# EAGLE design usb-can (EAGLE 9.1.3)
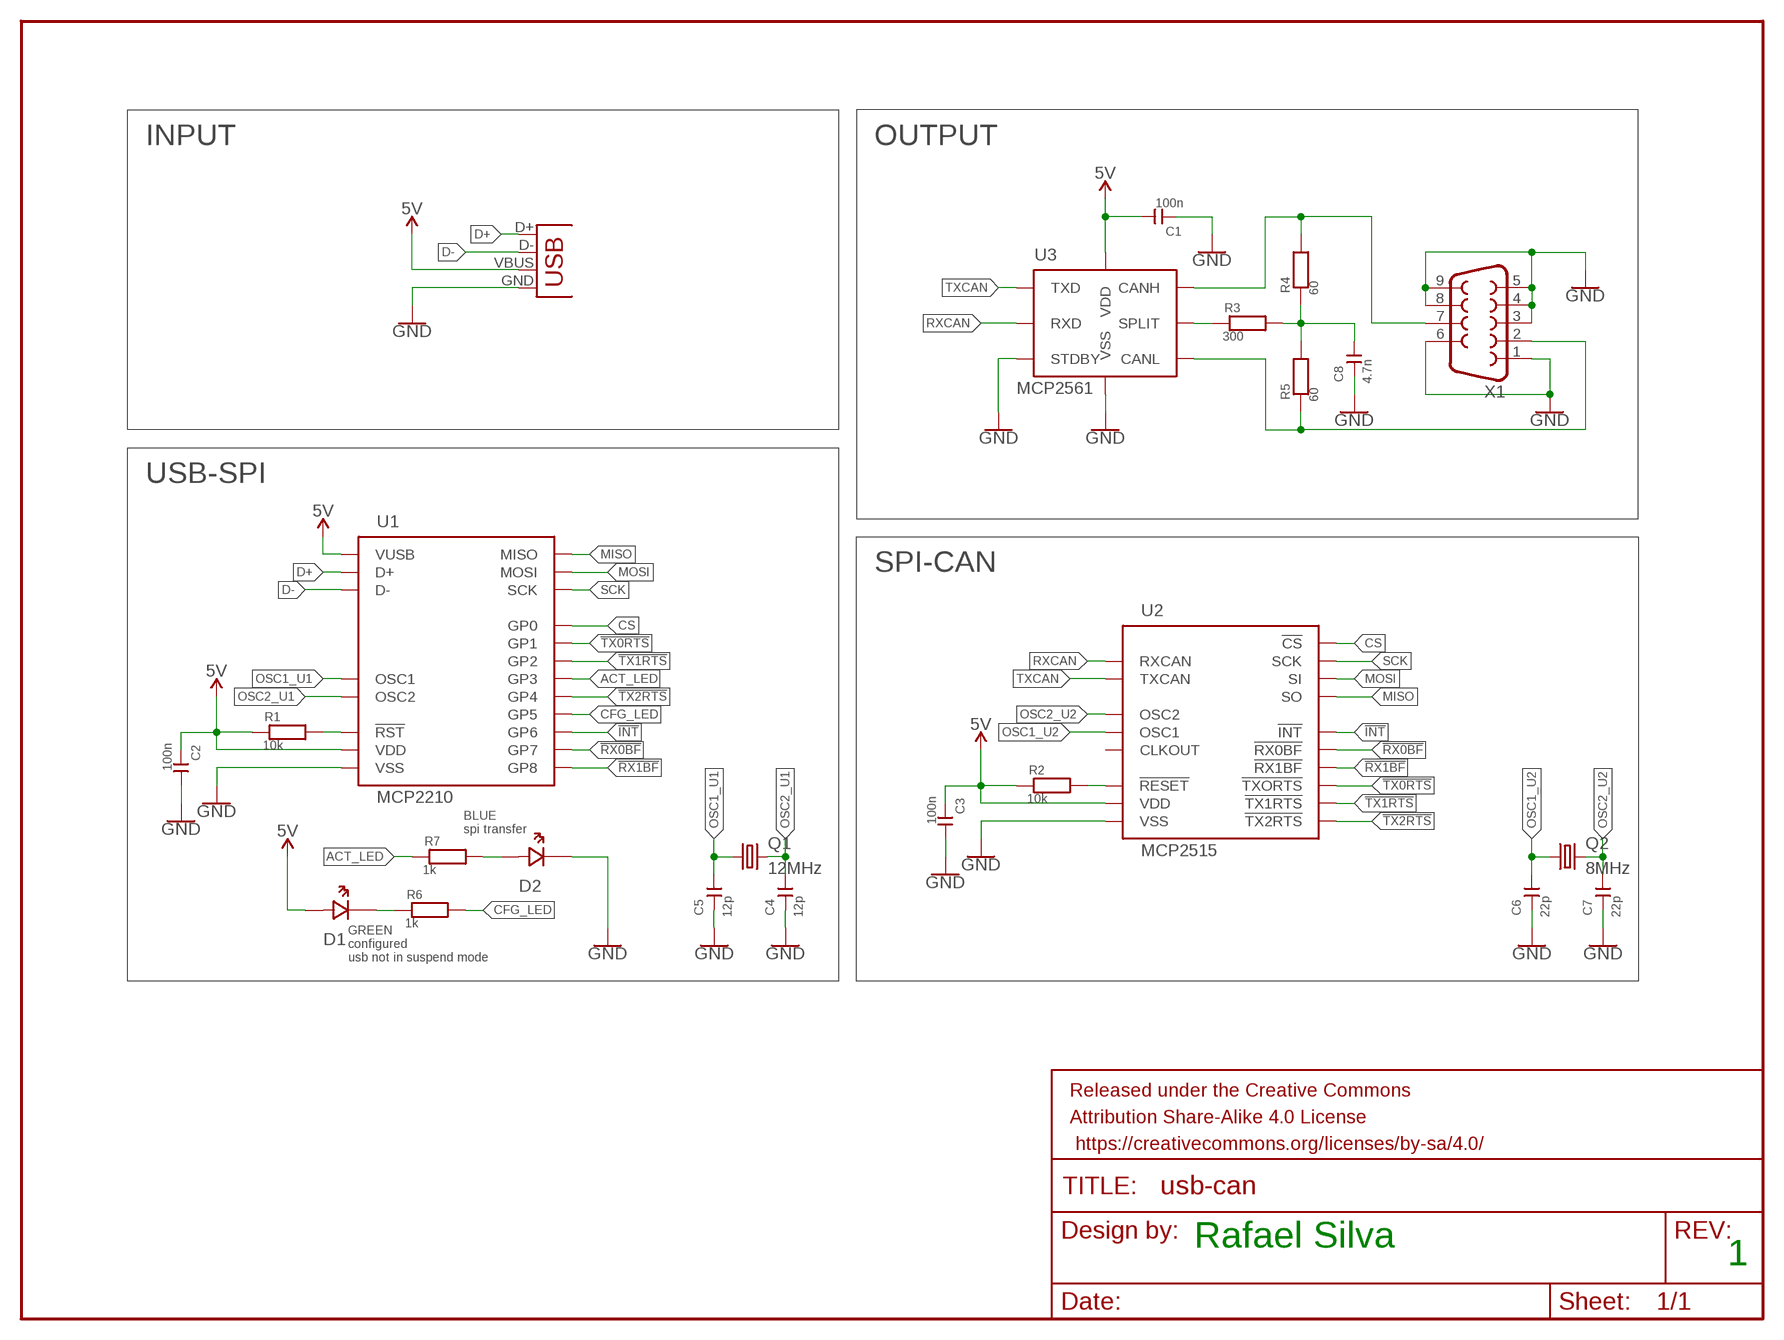
[diagram p0: schematic, sheet 1]

## Parts
C1  100n  CAPSMD  [0603_WAVE]
C2  100n  CAPSMD  [0603_WAVE]
C3  100n  CAPSMD  [0603_WAVE]
C4  12p  CAPSMD  [0603_WAVE]
C5  12p  CAPSMD  [0603_WAVE]
C6  22p  CAPSMD  [0603_WAVE]
C7  22p  CAPSMD  [0603_WAVE]
C8  4.7n  CAPSMD  [0603_WAVE]
D1  RED(nok)  SML-D12  [0603_LED]
D2  SML-D12  [0603_LED]
FRAME1  FRAME-LETTERNO_PACKAGE  [DUMMY]
Q1  12MHz  CRYSTALSM49  [SM49]
Q2  8MHz  CRYSTALSM49  [SM49]
R1  10k  RES0603  [0603_WAVE]
R2  10k  RES0603  [0603_WAVE]
R3  300  RES0603  [0603_WAVE]
R4  60  RES0603  [0603_WAVE]
R5  60  RES0603  [0603_WAVE]
R6  1k  RES0603  [0603_WAVE]
R7  1k  RES0603  [0603_WAVE]
U1  MCP2210  [SOIC-20_300MIL]
U2  MCP2515  [SOIC-18_300MIL]
U3  MCP2561  [SOIC_8]
X1  DB9MALE  [DB9_MALE]
X2  USBPTH  [USB-B-PTH]

## Nets
5V: C1.P$2 C2.P$1 C3.P$1 D1.P$2(AN) R1.P$1 R2.P$1 U1.P$1(VDD) U1.P$17(VUSB) U2.P$18(VDD) U3.P$3(VDD) X2.VBUS
!INT: U1.P$14(GP6) U2.P$12(!INT!)
!RX0BF: U1.P$15(GP7) U2.P$11(!RX0BF!)
!RX1BF: U1.P$16(GP8) U2.P$10(!RX1BF!)
!TX0RTS: U1.P$6(GP1) U2.P$4(!TXORTS!)
!TX1RTS: U1.P$7(GP2) U2.P$5(!TX1RTS!)
!TX2RTS: U1.P$10(GP4) U2.P$6(!TX2RTS!)
ACT_LED: R7.P$1 U1.P$8(GP3)
CFG_LED: R6.P$2 U1.P$12(GP5)
CS: U1.P$5(GP0) U2.P$16(!CS!)
D+: U1.P$19(D+) X2.D+
D-: U1.P$18(D-) X2.D-
GND: C1.P$1 C2.P$2 C3.P$2 C4.P$1 C5.P$1 C6.P$1 C7.P$1 C8.P$1 D2.P$1(CA) U1.P$20(VSS) U2.P$9(VSS) U3.P$2(VSS) U3.P$8(STDBY) X1.1 X1.3 X1.4 X1.5 X1.6 X1.8 X1.9 X2.GND
MISO: U1.P$13(MISO) U2.P$15(SO)
MOSI: U1.P$9(MOSI) U2.P$14(SI)
N$1: R2.P$2 U2.P$17(!RESET!)
N$2: R1.P$2 U1.P$4(!RST!)
N$3: R4.P$2 U3.P$7(CANH) X1.7
N$4: R5.P$1 U3.P$6(CANL) X1.2
N$5: R3.P$1 U3.P$5(SPLIT)
N$6: C8.P$2 R3.P$2 R4.P$1 R5.P$2
N$7: D1.P$1(CA) R6.P$1
N$8: D2.P$2(AN) R7.P$2
OSC1_U1: C5.P$2 Q1.1 U1.P$2(OSC1)
OSC1_U2: C6.P$2 Q2.1 U2.P$8(OSC1)
OSC2_U1: C4.P$2 Q1.2 U1.P$3(OSC2)
OSC2_U2: C7.P$2 Q2.2 U2.P$7(OSC2)
RXCAN: U2.P$2(RXCAN) U3.P$4(RXD)
SCK: U1.P$11(SCK) U2.P$13(SCK)
TXCAN: U2.P$1(TXCAN) U3.P$1(TXD)
Unconnected: U2.P$3(CLKOUT)

## Notes on the sheet
- INPUT | OUTPUT
- USB-SPI
- SPI-CAN
- BLUE
  spi transfer
- GREEN
  configured
  usb not in suspend mode
- Rafael Silva
- 1

## Library data of the parts
C1-C8 = KEMET:CAP: KEMET’s X7R dielectric features a 125°C maximum operating temperature and is considered temperature stable. The Electronics Components, Assemblies and Materials Association (EIA) characterizes X7R dielectric as a Class II material. Components of this classification are fixed, ceramic dielectric capacitors suited for bypass and decoupling applications or for frequency discriminating circuits where Q and stability of capacitance characteristics are not critical. X7R exhibits a predictable change in capacitance with respect to time and voltage, boasting a minimal change in capacitance with reference to ambient temperature. Capacitance change is limited to ±15% from −55°C to +125°C.
D1 D2 = ROHM:SML-D12
FRAME1 = SparkFun-Aesthetics:FRAME-LETTER: Schematic Frame - Letter Standard 8.5x11 US Letter frame; DESIGNER: Nobody; VERSION: v01
Q1 Q2 = crystal:CRYSTAL: CRYSTAL; OC_FARNELL: unknown; OC_NEWARK: unknown
R1-R7 = Vishay:RES
U1 = Microchip:MCP2210
U2 = Microchip:MCP2515
U3 = Microchip:MCP2561
X1 = SparkFun:DB9: DB9 Connector Standard DB9 (D-Sub 9) serial connector. Can be used for CAN bus as well as RS485 and RS232. Footprint production proven. Spark Fun Electronics SKU : PRT-00429
X2 = SparkFun:USB: USB Connectors USB-B-PTH is fully proven SKU : PRT-00139 USB-miniB is fully proven SKU : PRT-00587 USB-A-PCB is untested. USB-A-H is throughly reviewed, but untested. Spark Fun Electronics SKU : PRT-00437 USB-B-SMT is throughly reviewed, but untested. Needs silkscreen touching up. USB-A-S has not been used/tested USB-MB-H has not been used/tested

## Board
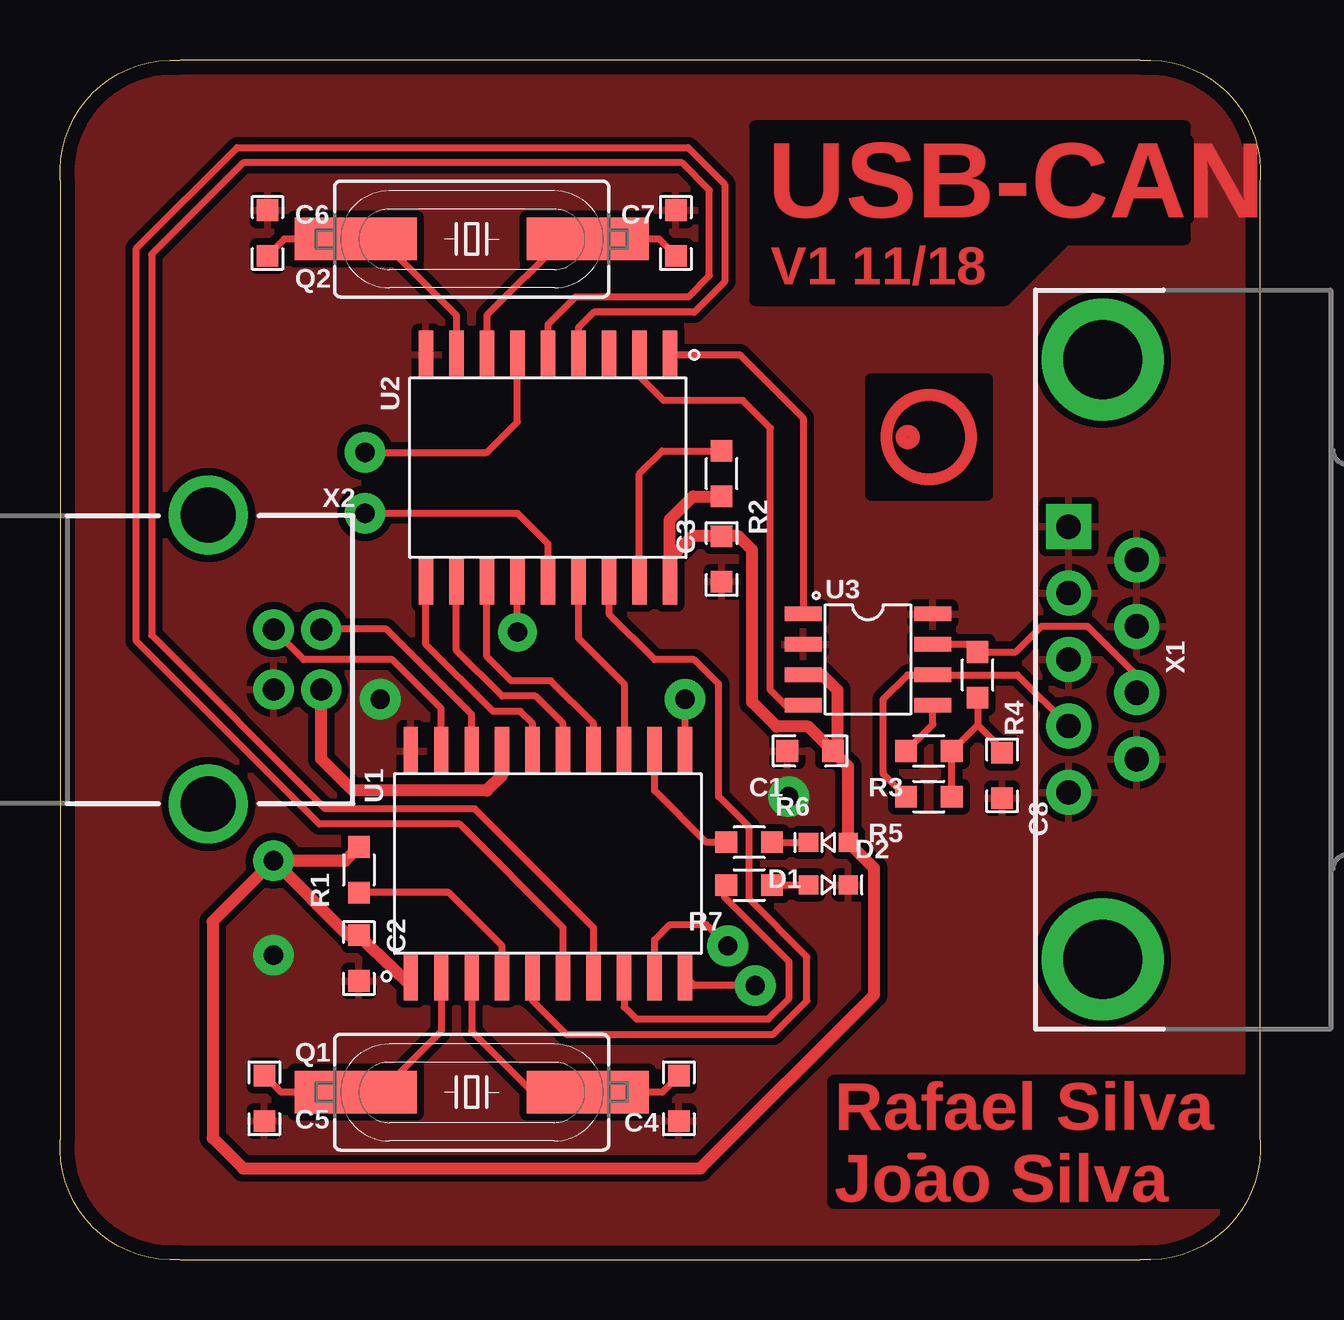
[diagram p1: board, top side]
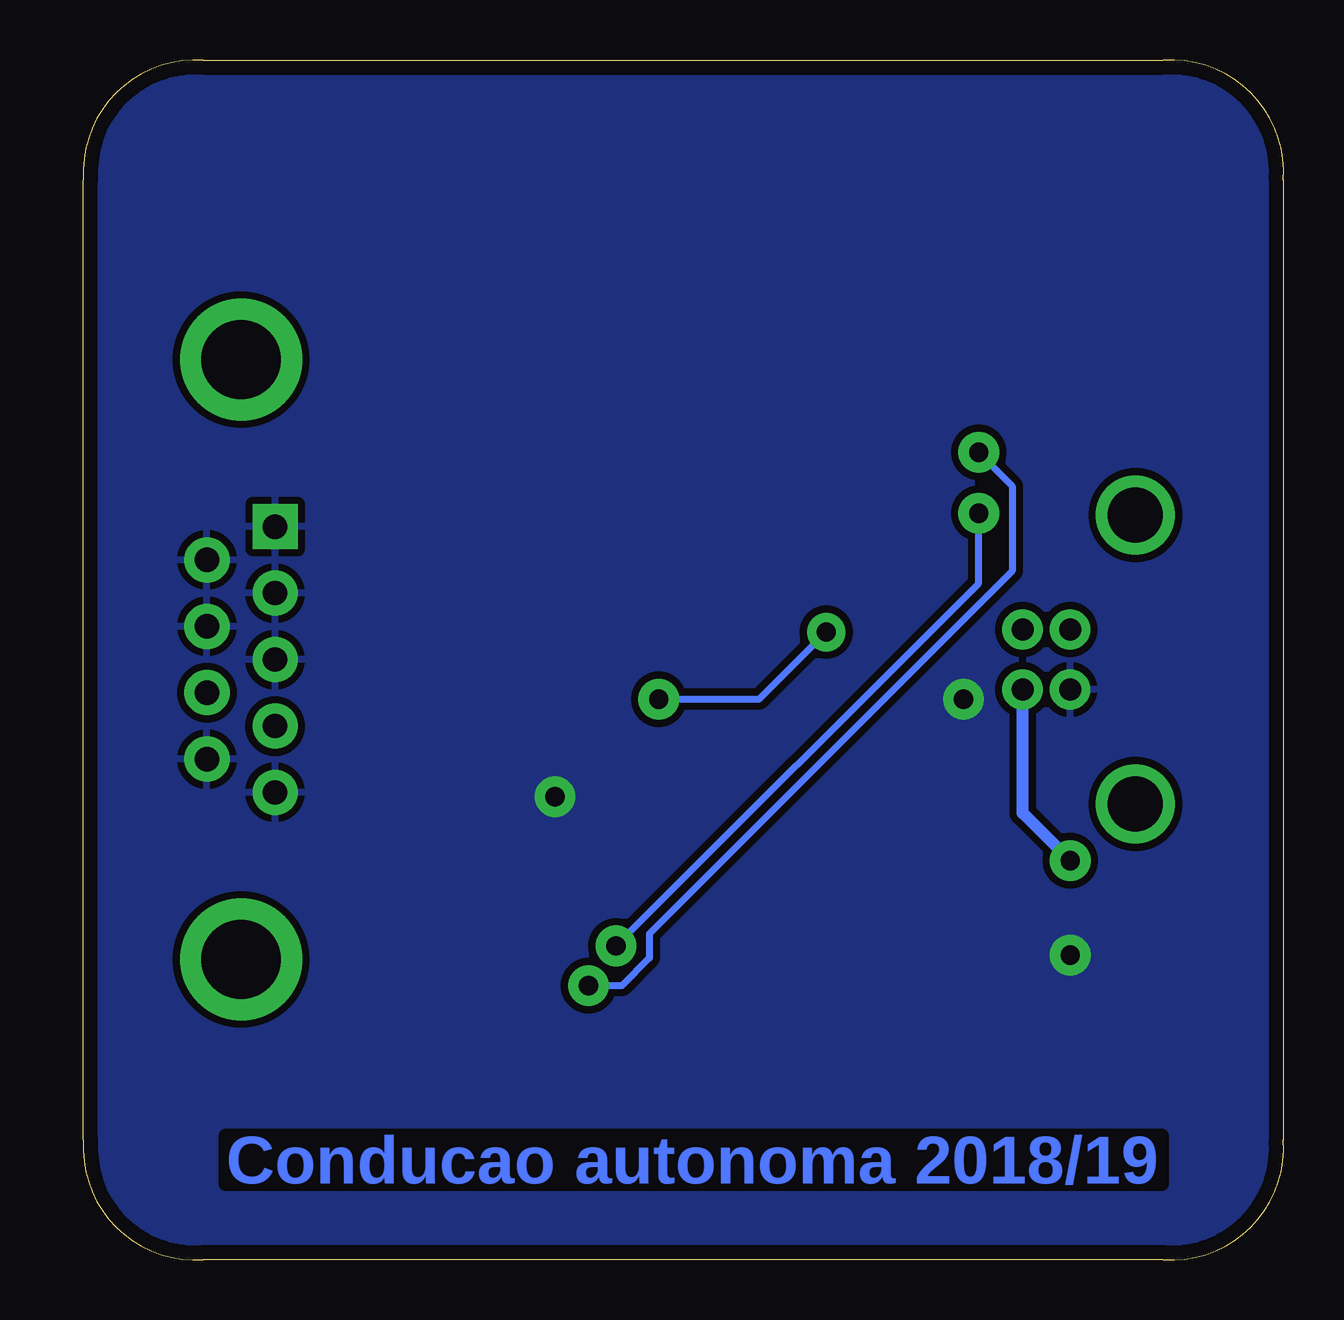
[diagram p2: board, bottom side, seen from below]

Size 50.02 x 50.02 mm. Coordinates in mm from the lower left corner, seen from the top.
Outline: 5.01,0.01 45.01,0.01 arc98 50.01,5.01 50.01,45.01 arc98 45.01,50.01 5.01,50.01 arc98 0.01,45.01 0.01,5.01 arc98 5.01,0.01
Copper layers (1*16): Top 0.035mm / dielectric 1.5mm / Bottom 0.035mm
Design rules "default *": minimum track width 0.3mm, minimum drill 0.35mm, track to track 0.3mm, track to pad 0.3mm, pad to pad 0.3mm, via to via 0.3mm, smd to smd 0.3mm, copper to edge 0.6mm, drill to drill 6mil, minimum pad ring 10mil, minimum via ring 8mil, stop-mask expansion 4mil, vias tented up to drill 0mil, thermal gap 0.3mm

### Footprints (pad centres in the part's own frame; a part is rotated, then mirrored left to right if it is on the bottom)
0603_WAVE = smd 0.9 x 0.9: P$1 -0.95,0; P$2 0.95,0
0603_LED = smd 0.8 x 0.8: P$1 -0.825,0; P$2 0.825,0
SM49 = smd 5.08 x 1.778: 1 -4.826,0; 2 4.826,0
SOIC-20_300MIL = smd 0.6 x 2: P$1 -5.08,-4.7; P$2 -3.81,-4.7; P$3 -2.54,-4.7; P$4 -1.27,-4.7; P$5 0,-4.7; P$6 1.27,-4.7; P$7 2.54,-4.7; P$8 3.81,-4.7; P$9 5.08,-4.7; P$10 6.35,-4.7; P$11 6.35,4.7; P$12 5.08,4.7; P$13 3.81,4.7; P$14 2.54,4.7; P$15 1.27,4.7; P$16 0,4.7; P$17 -1.27,4.7; P$18 -2.54,4.7; P$19 -3.81,4.7; P$20 -5.08,4.7
SOIC-18_300MIL = smd 0.6 x 2: P$1 -5.08,-4.7; P$2 -3.81,-4.7; P$3 -2.54,-4.7; P$4 -1.27,-4.7; P$5 0,-4.7; P$6 1.27,-4.7; P$7 2.54,-4.7; P$8 3.81,-4.7; P$9 5.08,-4.7; P$10 5.08,4.7; P$11 3.81,4.7; P$12 2.54,4.7; P$13 1.27,4.7; P$14 0,4.7; P$15 -1.27,4.7; P$16 -2.54,4.7; P$17 -3.81,4.7; P$18 -5.08,4.7
SOIC_8 = smd 0.6 x 1.55: P$1 -1.905,-2.7; P$2 -0.635,-2.7; P$3 0.635,-2.7; P$4 1.905,-2.7; P$5 1.905,2.7; P$6 0.635,2.7; P$7 -0.635,2.7; P$8 -1.905,2.7
DB9_MALE = drill 1.016 pad 1.88: 1 5.54,-1.42; 2 2.77,-1.42; 3 0,-1.42; 4 -2.77,-1.42; 6 4.15,1.42; 7 1.38,1.42; 8 -1.38,1.42; 9 -4.15,1.42 | drill 1.016 pad 1.88 square: 5 -5.54,-1.42 | drill 3.302 pad 5.08: G1 -12.5,0; G2 12.5,0
USB-B-PTH = drill 0.914 pad 1.676: D+ 0,1.25; D- 1.981,1.25; GND 0,-1.25; VBUS 1.981,-1.25 | drill 2.286: S1 -2.718,-6.02; S2 -2.718,6.02

### Placement (x,y rotation side)
C1  31.25,21.22 0 top
C2  12.46,12.58 270 top
C3  27.57,29.22 270 top
C4  25.79,6.74 90 top
C5  8.52,6.74 90 top
C6  8.65,42.81 270 top
C7  25.66,42.81 270 top
C8  39.25,20.2 90 top
D1  32.01,17.41 0 top
D2  32.01,15.63 180 top
FRAME1  0.01,0.01 0 top
Q1  17.15,6.99 0 top
Q2  17.15,42.55 0 top
R1  12.46,16.27 270 top
R2  27.57,32.78 90 top
R3  36.2,21.22 0 top
R4  38.24,24.39 90 top
R5  36.2,19.31 0 top
R6  28.71,17.41 180 top
R7  28.71,15.63 0 top
U1  19.69,16.52 0 top
U2  20.33,33.03 180 top
U3  33.66,25.03 270 top
X1  43.44,25.03 270 top
X2  8.9,25.03 0 top

### Tracks (layer width: path | path; a pad name or v marks a point on that pad's centre or on a via)
5V  (via drill 0.8 pad 1.7)
  Top 0.3: U3.P$3 31.76,24.39 | U2.P$18 25.41,29.22
  Top 0.5: C1.P$2 32.84,20.58 D1.P$2 33.92,16.33 33.92,11.06 26.68,3.82 7.63,3.82 6.36,5.09 6.36,14.11 v8.9,16.65 | 31.76,24.39 32.39,23.76 32.39,21.41 C1.P$2 | R2.P$1 26.36,31.83 25.41,30.87 25.41,29.22 26.36,30.17 C3.P$1 28.27,30.17 28.84,29.6 28.84,23.25 29.85,22.23 31.19,22.23 C1.P$2 | U1.P$1 14.43,11.63 C2.P$1 12.01,13.53 v8.9,16.65 | U1.P$17 18.42,20.2 17.79,19.57 12.2,19.57 10.88,20.89 X2.VBUS | v8.9,16.65 11.89,16.65 R1.P$1
  Bottom 0.5: v8.9,16.65 10.88,18.63 X2.VBUS
!INT
  Top 0.3: U1.P$14 22.23,22.36 20.46,24.14 18.8,24.14 17.79,25.16 U2.P$12
!RX0BF
  Top 0.3: U1.P$15 20.96,22.36 19.82,23.51 18.42,23.51 16.52,25.41 U2.P$11
!RX1BF
  Top 0.3: U1.P$16 19.69,22.36 19.19,22.87 18.04,22.87 15.25,25.66 U2.P$10
!TX0RTS
  Top 0.3: U1.P$6 20.96,13.85 16.65,18.17 10.8,18.17 3.18,25.79 3.18,42.17 7.38,46.36 26.17,46.36 27.7,44.84 27.7,40.78 26.43,39.51 22.23,39.51 21.6,38.87 U2.P$4
!TX1RTS
  Top 0.3: U1.P$7 22.23,13.85 17.28,18.81 11.06,18.81 3.82,26.04 3.82,41.92 7.63,45.73 25.92,45.73 27.06,44.59 27.06,41.03 26.17,40.14 21.47,40.14 20.33,39 U2.P$5
!TX2RTS  (via drill 0.8 pad 1.7)
  Top 0.3: v28.97,11.44 26.42,11.44 U1.P$10 | U2.P$6 19.06,34.93 17.79,33.66 v12.71,33.66
  Bottom 0.3: v28.97,11.44 27.57,11.44 26.43,12.58 26.43,13.6 11.31,28.71 11.31,32.27 v12.71,33.66
ACT_LED
  Top 0.3: U1.P$8 23.5,10.55 24.01,10.04 29.51,10.04 30.38,10.91 30.38,12.44 27.7,15.12 27.7,15.56 R7.P$1
CFG_LED
  Top 0.3: R6.P$2 26.93,17.41 24.77,19.57 U1.P$12
CS
  Top 0.3: U1.P$5 19.69,10.8 21.09,9.41 29.73,9.41 31.12,10.8 31.12,12.63 28.71,15.04 28.71,18.04 27.44,19.31 27.44,24.01 26.43,25.03 24.77,25.03 22.87,26.93 U2.P$16
D+
  Top 0.3: U1.P$19 15.88,23 13.85,25.03 10.15,25.03 X2.D+
D-
  Top 0.3: U1.P$18 17.15,22.74 13.6,26.3 10.9,26.3 X2.D-
GND  (via drill 0.8 pad 1.7)
  other vias: 13.34,23.38 30.36,19.31 8.9,12.71
  pour Bottom: -2.53,52.08 54.62,52.08 54.62,-2.53 -1.26,-2.53 -2.53,-2.53
  pour Top: -1.26,50.81 50.81,50.81 50.81,-1.26 -1.26,-1.26
MISO
  Top 0.3: U2.P$15 21.6,25.92 23.5,24.01 U1.P$13
MOSI  (via drill 0.8 pad 1.7)
  Top 0.3: U1.P$9 24.77,13.34 25.41,13.98 26.93,13.98 v27.82,13.09 | v12.71,31.12 19.06,31.12 20.33,29.85 U2.P$14
  Bottom 0.3: v27.82,13.09 12.71,28.2 v12.71,31.12
N$1
  Top 0.3: U2.P$17 24.14,32.78 25.09,33.73 R2.P$2
N$2
  Top 0.3: U1.P$4 18.42,13.09 16.2,15.32 R1.P$2
N$3
  Top 0.3: U3.P$7 37.92,25.66 R4.P$2 39.82,25.34 40.9,26.43 42.81,26.43 44.86,24.37 X1.7
N$4
  Top 0.3: R5.P$1 34.3,20.27 34.3,23.38 35.32,24.39 U3.P$6 39.89,24.39 X1.2
N$5
  Top 0.3: R3.P$1 36.36,22.33 U3.P$5
N$6
  Top 0.3: R5.P$2 R3.P$2 38.24,22.3 | R4.P$1 38.24,22.3 | C8.P$2 39.25,21.28 38.24,22.3
N$7
  Top 0.3: R6.P$1 D1.P$1
N$8
  Top 0.3: R7.P$2 D2.P$2
N$9
  Top 0.3: 35.95,4.33 35.44,4.33
NULL
  cutout Top: 28.97,47.25 28.97,40.01 39.38,40.01 41.92,42.55 46.87,42.55 46.87,47.25
  cutout Top: 33.79,36.71 38.62,36.71 38.62,31.89 33.79,31.89
  cutout Top: 26.04,36.71 14.61,36.71 14.61,29.35 26.04,29.35
NULL1
  cutout Top: 26.68,20.2 13.98,20.2 13.98,12.84 26.68,12.84
OSC1_U1
  Top 0.3: U1.P$2 15.88,9.53 13.34,6.99 Q1.1 9.21,6.99 C5.P$2
OSC1_U2
  Top 0.3: U2.P$8 16.52,39.38 13.34,42.55 Q2.1 9.34,42.55 C6.P$2
OSC2_U1
  Top 0.3: U1.P$3 17.15,9.53 19.69,6.99 Q1.2 25.09,6.99 C4.P$2
OSC2_U2
  Top 0.3: U2.P$7 17.79,39.38 20.96,42.55 Q2.2 24.97,42.55 C7.P$2
RXCAN
  Top 0.3: U2.P$2 24.14,36.84 25.16,35.82 28.46,35.82 29.6,34.68 29.6,23.76 30.24,23.12 U3.P$4
SCK  (via drill 0.8 pad 1.6, 0.8 pad 1.7)
  Top 0.3: U1.P$11 v26.04,23.38 | v19.06,26.17 U2.P$13
  Bottom 0.3: v26.04,23.38 21.85,23.38 v19.06,26.17
TXCAN
  Top 0.3: U2.P$1 28.33,37.73 30.96,35.09 U3.P$1
(copper drawn outside any net)
  shapes: Top circle x2

### Text on the board
Top: USB-CAN | V1 11/18 | Rafael Silva / Joao Silva
Bottom: Conducao autonoma 2018/19